# EAGLE design capelet_gps (EAGLE 9.4.2)
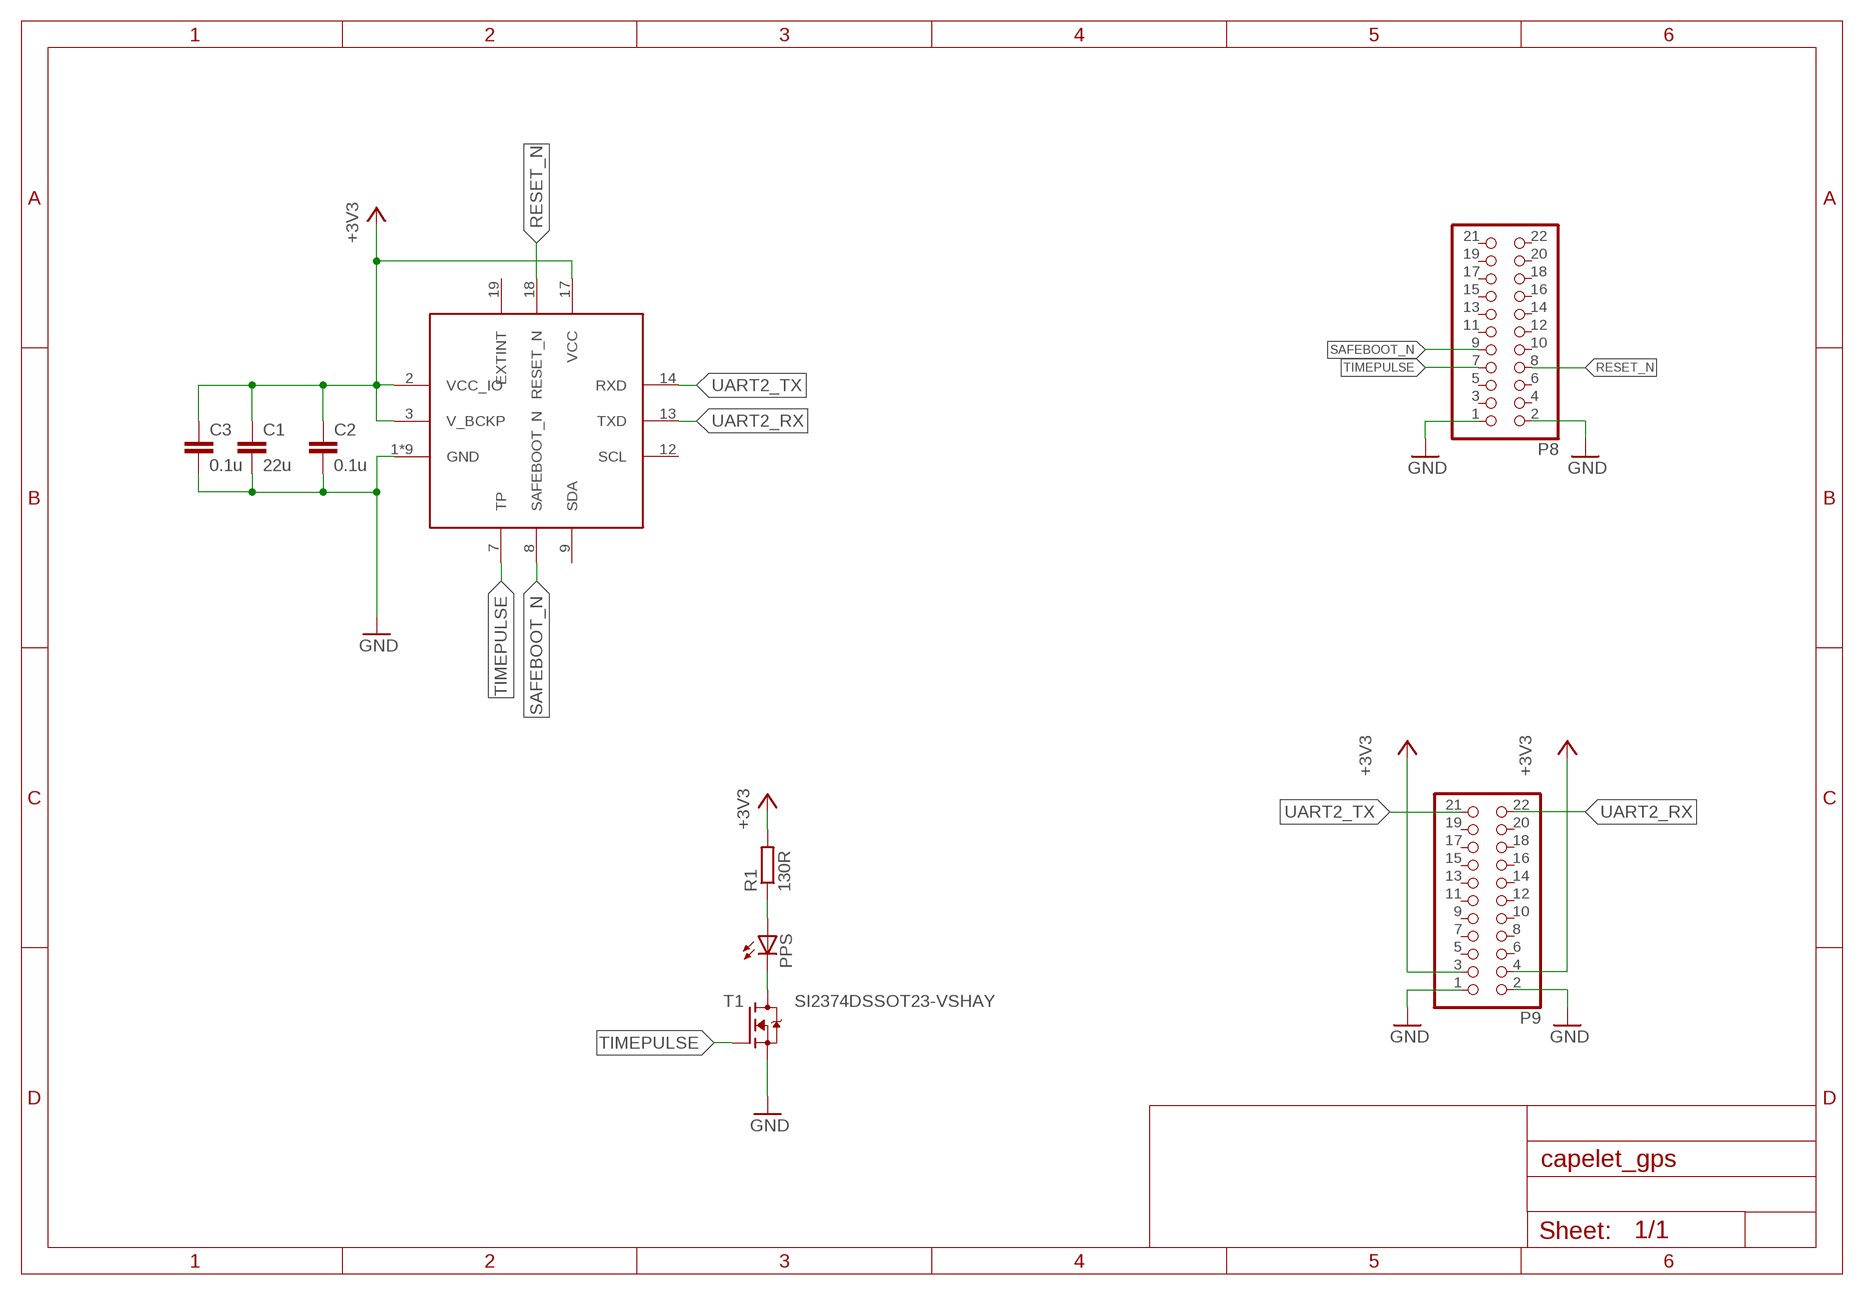
[diagram p0: schematic, sheet 1]

## Parts
C1  22u  C_SMD1210  [CAPC3225X280]
C2  0.1u  C_SMD0805  [CAPC2012X145]
C3  0.1u  C_SMD0805  [CAPC2012X145]
IC1  SAM-M8Q  [SAM-M8Q]
P8  PINHD-2X11  [2X11]
P9  PINHD-2X11  [2X11]
PPS  598-8130-107FLED_0805  [LEDC2012X75]
R1  130R  R_SMD0805  [RESC2012X65]
T1  SI2374DSSOT23-VSHAY  [SOT95P237X112-3]

## Nets
+3V3: C1.1 C2.1 C3.1 IC1.2(VCC_IO) IC1.3(V_BCKP) IC1.17(VCC) P9.3 P9.4 R1.2
GND: C1.2 C2.2 C3.2 IC1.1(GND) IC1.4(GND) IC1.5(GND) IC1.6(GND) IC1.10(GND) IC1.11(GND) IC1.15(GND) IC1.16(GND) IC1.20(GND) P8.1 P8.2 P9.1 P9.2 T1.2(S)
N$1: PPS.1(C) T1.3(D)
N$2: PPS.2(A) R1.1
RESET_N: IC1.18(RESET_N) P8.8
SAFEBOOT_N: IC1.8(SAFEBOOT_N) P8.9
TIMEPULSE: IC1.7(TP) P8.7 T1.1(G)
UART2_RX: IC1.13(TXD) P9.22
UART2_TX: IC1.14(RXD) P9.21
Unconnected: IC1.9(SDA) IC1.12(SCL) IC1.19(EXTINT) P8.3 P8.4 P8.5 P8.6 P8.10 P8.11 P8.12 P8.13 P8.14 P8.15 P8.16 P8.17 P8.18 P8.19 P8.20 P8.21 P8.22 P9.5 P9.6 P9.7 P9.8 P9.9 P9.10 P9.11 P9.12 P9.13 P9.14 P9.15 P9.16 P9.17 P9.18 P9.19 P9.20

## Library data of the parts
C1-C3 = shepherd:C_SMD
IC1 = shepherd:SAM-M8Q: u-blox SAM GNSS antenna module
P8 P9 = shepherd:PINHD-2X11: PIN HEADER
PPS = shepherd:598-8130-107F
R1 = shepherd:R_SMD
T1 = shepherd:SI2374DS

## Board
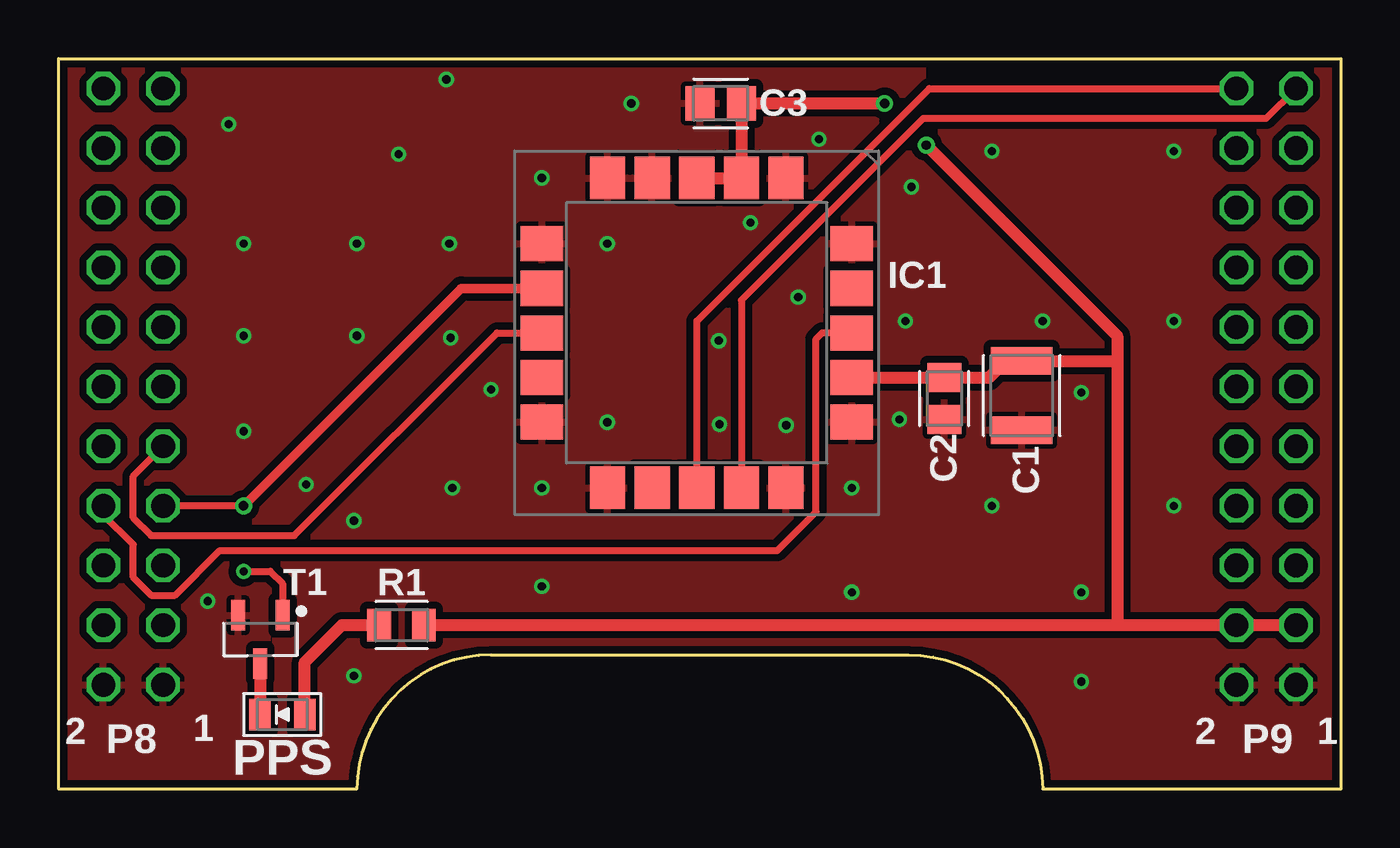
[diagram p1: board, top side]
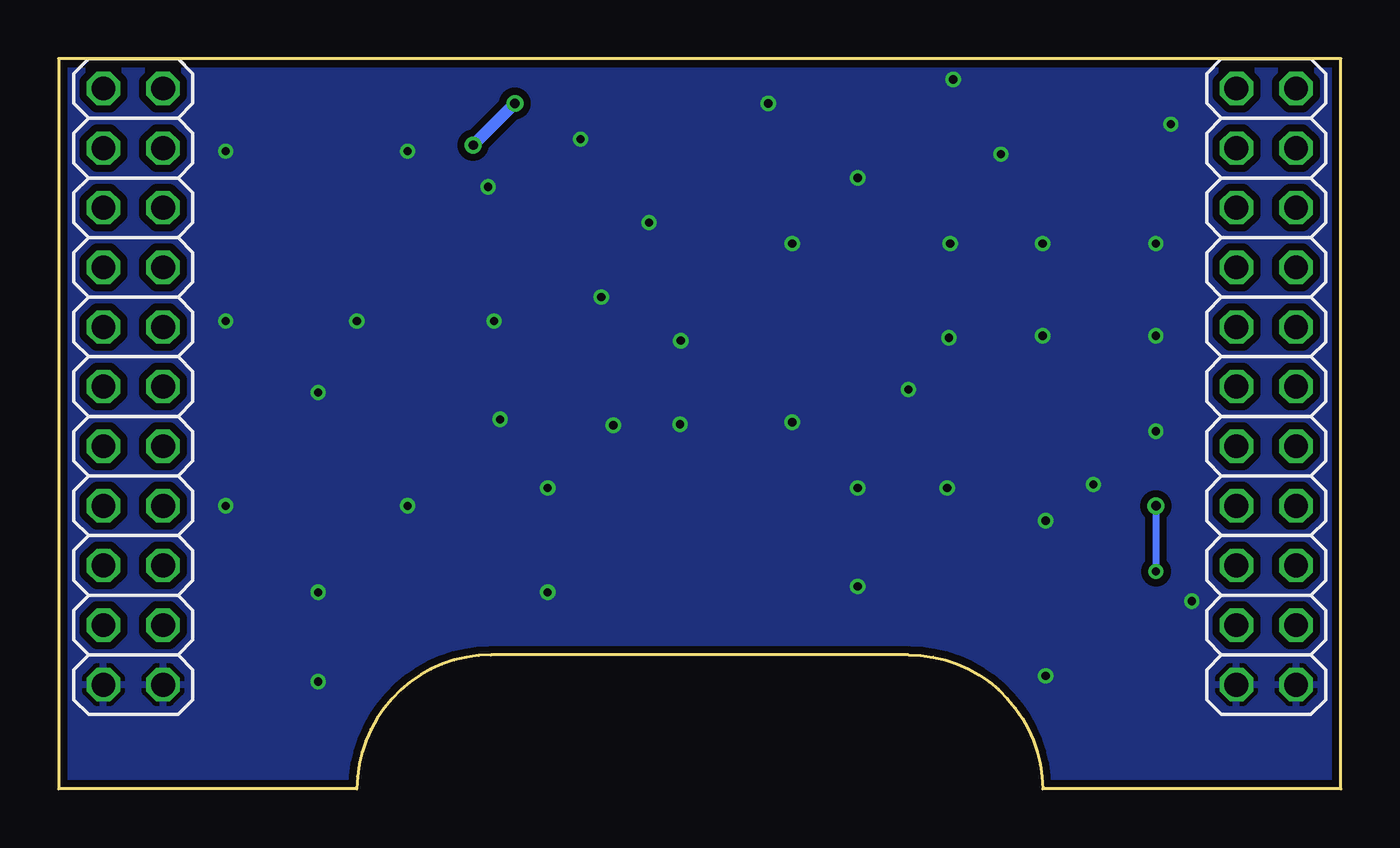
[diagram p2: board, bottom side, seen from below]

Size 54.61 x 31.11 mm. Coordinates in mm from the lower left corner, seen from the top.
Copper layers (1*16): Top 0.035mm / dielectric 1.5mm / Bottom 0.035mm
Design rules "PCB-POOL Standard *": minimum track width 0.15mm, minimum drill 0.3mm, track to track 0.15mm, track to pad 0.15mm, pad to pad 0.15mm, via to via 0.15mm, smd to smd 0.15mm, copper to edge 0.3mm, drill to drill 0.2mm, minimum pad ring 0.2mm, minimum via ring 0.15mm, stop-mask expansion 0.075mm, vias tented up to drill 20mil, thermal gap 0.2mm

### Footprints (pad centres in the part's own frame; a part is rotated, then mirrored left to right if it is on the bottom)
CAPC3225X280 = smd 1.178 x 2.625: 1 -1.477,0; 2 1.477,0
CAPC2012X145 = smd 1.234 x 1.453: 1 -0.884,0; 2 0.884,0
SAM-M8Q = smd 1.8 x 1.5: 1 -6.6,3.8; 2 -6.6,1.9; 3 -6.6,0; 4 -6.6,-1.9; 5 -6.6,-3.8; 11 6.6,-3.8; 12 6.6,-1.9; 13 6.6,0; 14 6.6,1.9; 15 6.6,3.8 | smd 1.5 x 1.8: 6 -3.8,-6.6; 7 -1.9,-6.6; 8 0,-6.6; 9 1.9,-6.6; 10 3.8,-6.6; 16 3.8,6.6; 17 1.9,6.6; 18 0,6.6; 19 -1.9,6.6; 20 -3.8,6.6
2X11 = drill 1.016 octagon: 1 -12.7,1.27; 2 -12.7,-1.27; 3 -10.16,1.27; 4 -10.16,-1.27; 5 -7.62,1.27; 6 -7.62,-1.27; 7 -5.08,1.27; 8 -5.08,-1.27; 9 -2.54,1.27; 10 -2.54,-1.27; 11 0,1.27; 12 0,-1.27; 13 2.54,1.27; 14 2.54,-1.27; 15 5.08,1.27; 16 5.08,-1.27; 17 7.62,1.27; 18 7.62,-1.27; 19 10.16,1.27; 20 10.16,-1.27; 21 12.7,1.27; 22 12.7,-1.27
LEDC2012X75 = smd 0.91 x 1.35: 1 -0.96,0; 2 0.96,0
RESC2012X65 = smd 1.015 x 1.379: 1 -0.95,0; 2 0.95,0
SOT95P237X112-3 = smd 1.298 x 0.597: 1 -1.027,0.95; 2 -1.027,-0.95; 3 1.027,0

### Placement (x,y rotation side)
C1  41.02,16.76 270 top
C2  37.72,16.64 270 top
C3  28.19,29.21 180 top
IC1  27.18,19.43 270 top
P8  3.17,17.14 90 bottom
P9  51.44,17.14 90 bottom
PPS  9.53,3.17 0 top
R1  14.61,6.99 0 top
T1  8.59,6.38 270 top
U$1  [REFMARK]  10.29,24.64 0 top
U$2  [REFMARK]  45.85,26.92 0 top
U$3  [SHPRD_CPLT_G]  -0.64,-0.64 0 top
U$4  [REFMARK]  46.1,1.52 0 top

### Tracks (layer width: path | path; a pad name or v marks a point on that pad's centre or on a via)
+3V3  (via drill 0.4)
  Top 0.508: IC1.17 C2.1 39.62,17.52 40.34,18.24 C1.1 45.04,18.24 45.09,18.29 | C3.1 | C3.1 IC1.2 IC1.3 | R1.2 45.09,6.99 | 45.09,18.29 45.09,6.99 | C3.1 v35.18,29.21 | v36.96,27.43 45.09,19.3 45.09,18.29 | 45.09,6.99 P9.4 P9.3
  Bottom 0.508: v35.18,29.21 v36.96,27.43
GND  (via drill 0.35)
  other vias: 28.14,15.54 28.12,19.1 10.54,12.98 16.69,19.23 20.57,12.83 33.78,12.83 30.99,15.49 20.57,26.04 23.37,23.24 32.39,27.69 31.5,20.95 6.35,8 12.57,4.83 23.37,15.62 29.46,24.13 41.91,19.94 36.07,19.94 36.32,25.65 24.38,29.21 35.81,15.75 43.56,16.89 43.56,8.38 39.75,12.06 20.57,8.64 33.78,8.38 16.64,23.24 7.87,23.24 7.87,19.3 7.87,15.24 12.7,19.3 12.7,23.24 14.48,27.05 7.24,28.32 16.51,30.23 39.75,27.18 47.5,19.94 47.5,12.06 16.76,12.83 12.57,11.43 18.41,17.02 43.56,4.57 47.5,27.18
  pour Top (isolate 0.305, rank 2): 0,31.11 54.61,31.11 54.61,0 0,0
  pour Bottom (isolate 0.305): 0,31.11 54.61,31.11 54.61,0 0,0
KEEPOUT_GND
  cutout Top: 37.08,31.11 37.08,28.57 51.44,28.57 52.71,29.84 52.71,31.11
N$1
  Top 0.508: T1.3 8.59,3.2 PPS.1
N$2
  Top 0.508: PPS.2 10.48,5.41 12.06,6.99 R1.1
RESET_N
  Top 0.305: IC1.18 32.51,19.43 32.26,19.18 32.26,11.81 30.61,10.16 6.86,10.16 4.95,8.26 3.94,8.26 3.17,9.02 3.17,10.41 1.91,11.68 P8.8
SAFEBOOT_N
  Top 0.305: IC1.8 18.67,19.43 10.03,10.79 3.94,10.79 3.17,11.56 3.17,13.34 P8.9
TIMEPULSE  (via drill 0.35, 0.4)
  Top 0.305: v7.87,9.27 9.02,9.27 9.54,8.75 T1.1 | v7.87,12.06 P8.7
  Top 0.406: IC1.7 17.14,21.33 v7.87,12.06
  Bottom 0.305: v7.87,12.06 v7.87,9.27
UART2_RX
  Top 0.305: IC1.13 27.18,19.94 37.08,29.84 P9.22
UART2_TX
  Top 0.305: IC1.14 29.08,20.82 36.83,28.57 51.44,28.57 P9.21

### Text on the board
tNames: 2 | 1 | 2 | 1
tStop: SHEPHERD v1.5 / CAPELET GPS
tDocu: P9: pins pointing to bottom, solder on top | P8: pins pointing to bottom, solder on top